# EAGLE design LevelShifter_Rev02 (EAGLE 6.5.0)
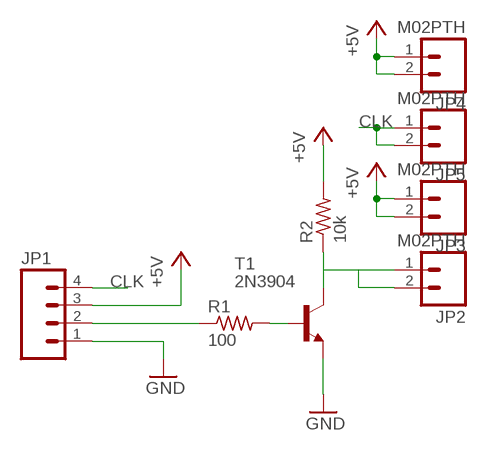
[diagram p0: schematic, sheet 1]

## Parts
JP1  M04SCREW  [SCREWTERMINAL-3.5MM-4]
JP2  M02PTH  [1X02]
JP3  M02PTH  [1X02]
JP4  M02PTH  [1X02]
JP5  M02PTH  [1X02]
R1  100  R-US_0204/7  [0204/7]
R2  10k  R-US_0204/7  [0204/7]
T1  2N3904  [TO92]

## Nets
+5V: JP1.3 JP3.1 JP3.2 JP4.1 JP4.2 R2.2
CLK: JP1.4 JP5.1 JP5.2
GND: JP1.1 T1.3(E)
N$1: R1.2 T1.2(B)
N$2: JP2.1 JP2.2 R2.1 T1.1(C)
N$3: JP1.2 R1.1

## Library data of the parts
JP1 = SparkFun-Connectors:M04: Header 4 Standard 4-pin 0.1" header. Use with straight break away headers (SKU : PRT-00116), right angle break away headers (PRT-00553), swiss pins (PRT-00743), machine pins (PRT-00117), and female headers (PRT-00115). Molex polarized connector foot print use with SKU : PRT-08231 with associated crimp pins and housings. 1MM SMD Version SKU: PRT-10208
JP2-JP5 = SparkFun-Connectors:M02: Standard 2-pin 0.1" header. Use with - straight break away headers ( PRT-00116) - right angle break away headers (PRT-00553) - swiss pins (PRT-00743) - machine pins (PRT-00117) - female headers (PRT-00115) Molex polarized connector foot print use with: PRT-08233 with associated crimp pins and housings. 2.54_SCREWTERM for use with PRT-10571. 3.5mm Screw Terminal footprints for PRT-08084 5mm Screw Terminal footprints for use with PRT-08433
R1 R2 = rcl:R-US_: RESISTOR, American symbol
T1 = transistor:2N3904: NPN TRANSISTOR

## Board
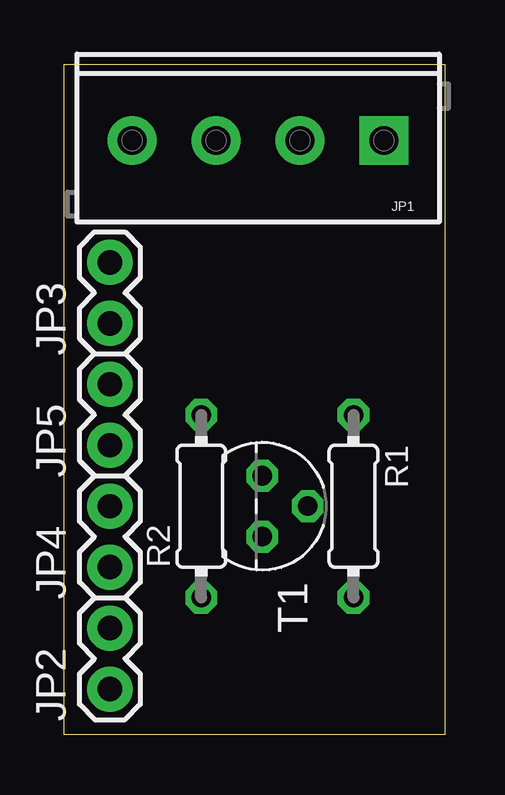
[diagram p1: board, top side]
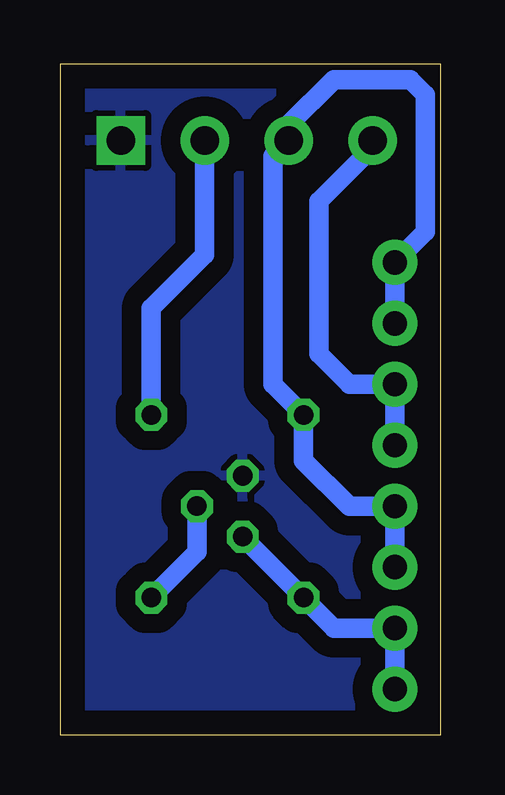
[diagram p2: board, bottom side, seen from below]

Size 15.88 x 27.94 mm. Coordinates in mm from the lower left corner, seen from the top.
Outline: 0,27.94 15.88,27.94 15.88,0 0,0 0,27.94
Copper layers (1*16): Top 0.035mm / dielectric 1.5mm / Bottom 0.035mm
Design rules "default": minimum track width 10mil, minimum drill 24mil, track to track 8mil, track to pad 8mil, pad to pad 8mil, via to via 8mil, smd to smd 8mil, copper to edge 40mil, drill to drill 8mil, minimum pad ring 10mil, minimum via ring 8mil, stop-mask expansion 4mil, vias tented up to drill 0mil, thermal gap 10mil

### Footprints (pad centres in the part's own frame; a part is rotated, then mirrored left to right if it is on the bottom)
SCREWTERMINAL-3.5MM-4 = drill 1.2 pad 2.032 square: 1 0,0 | drill 1.2 pad 2.032: 2 3.5,0; 3 7,0; 4 10.5,0
1X02 = drill 1.016 pad 1.88: 1 0,0; 2 2.54,0
0204/7 = drill 0.813 octagon: 1 -3.81,0; 2 3.81,0
TO92 = drill 0.813 octagon: 1 1.27,0; 2 0,1.905; 3 -1.27,0

### Placement (x,y rotation side)
JP1  13.34,24.77 180 top
JP2  1.9,1.91 90 top
JP3  1.9,17.14 90 top
JP4  1.9,6.98 90 top
JP5  1.9,12.07 90 top
R1  12.06,9.53 270 top
R2  5.71,9.53 90 top
T1  8.25,9.53 270 top

### Tracks (layer width: path | path; a pad name or v marks a point on that pad's centre or on a via)
+5V
  Bottom 0.813: JP4.1 JP4.2 3.81,9.53 5.71,11.43 R2.2 6.98,14.61 6.98,24.11 JP1.3 6.34,25.41 4.45,27.31 1.27,27.31 0.63,26.67 0.63,20.96 JP3.2 JP3.1
CLK
  Bottom 0.813: JP5.1 JP5.2 3.81,14.61 5.08,15.88 5.08,22.23 2.84,24.47 JP1.4
GND
  pour Bottom (isolate 0.813): 0,27.94 15.88,27.94 15.88,0 0,0
N$1
  Bottom 0.813: T1.2 10.16,7.62 R1.2
N$2
  Bottom 0.813: JP2.1 JP2.2 4.45,4.45 R2.1 T1.1
N$3
  Bottom 0.813: JP1.2 9.84,20.01 12.06,17.78 R1.1